# EAGLE schematic Main board (EAGLE 9.6.2)
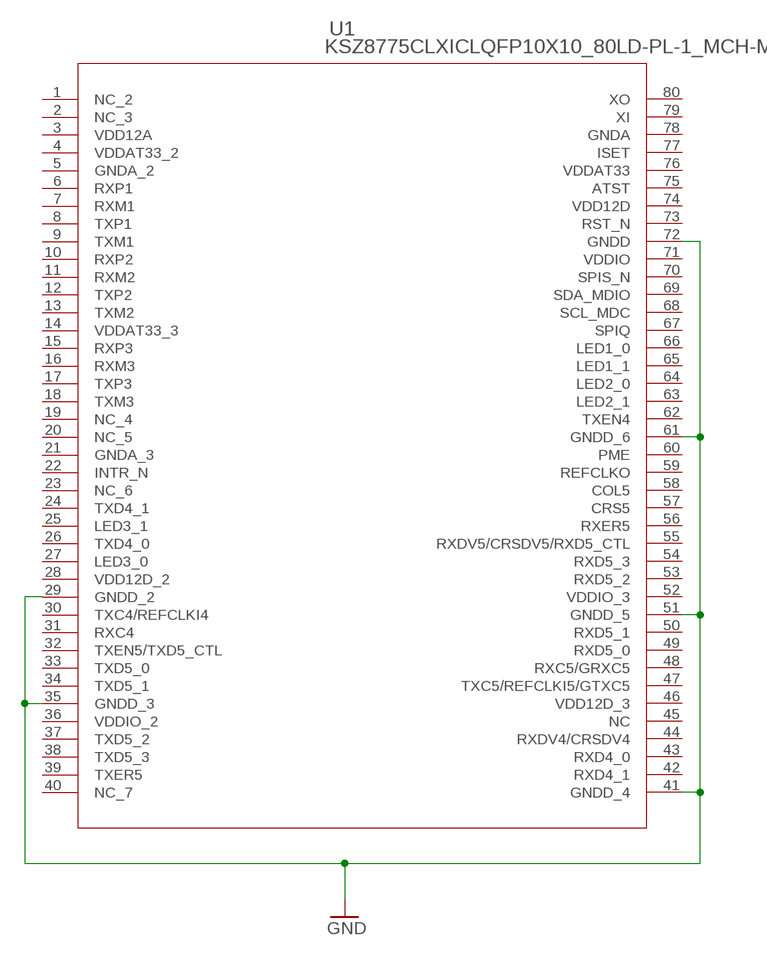
[diagram p0: schematic, sheet 1, part 1 of 2]
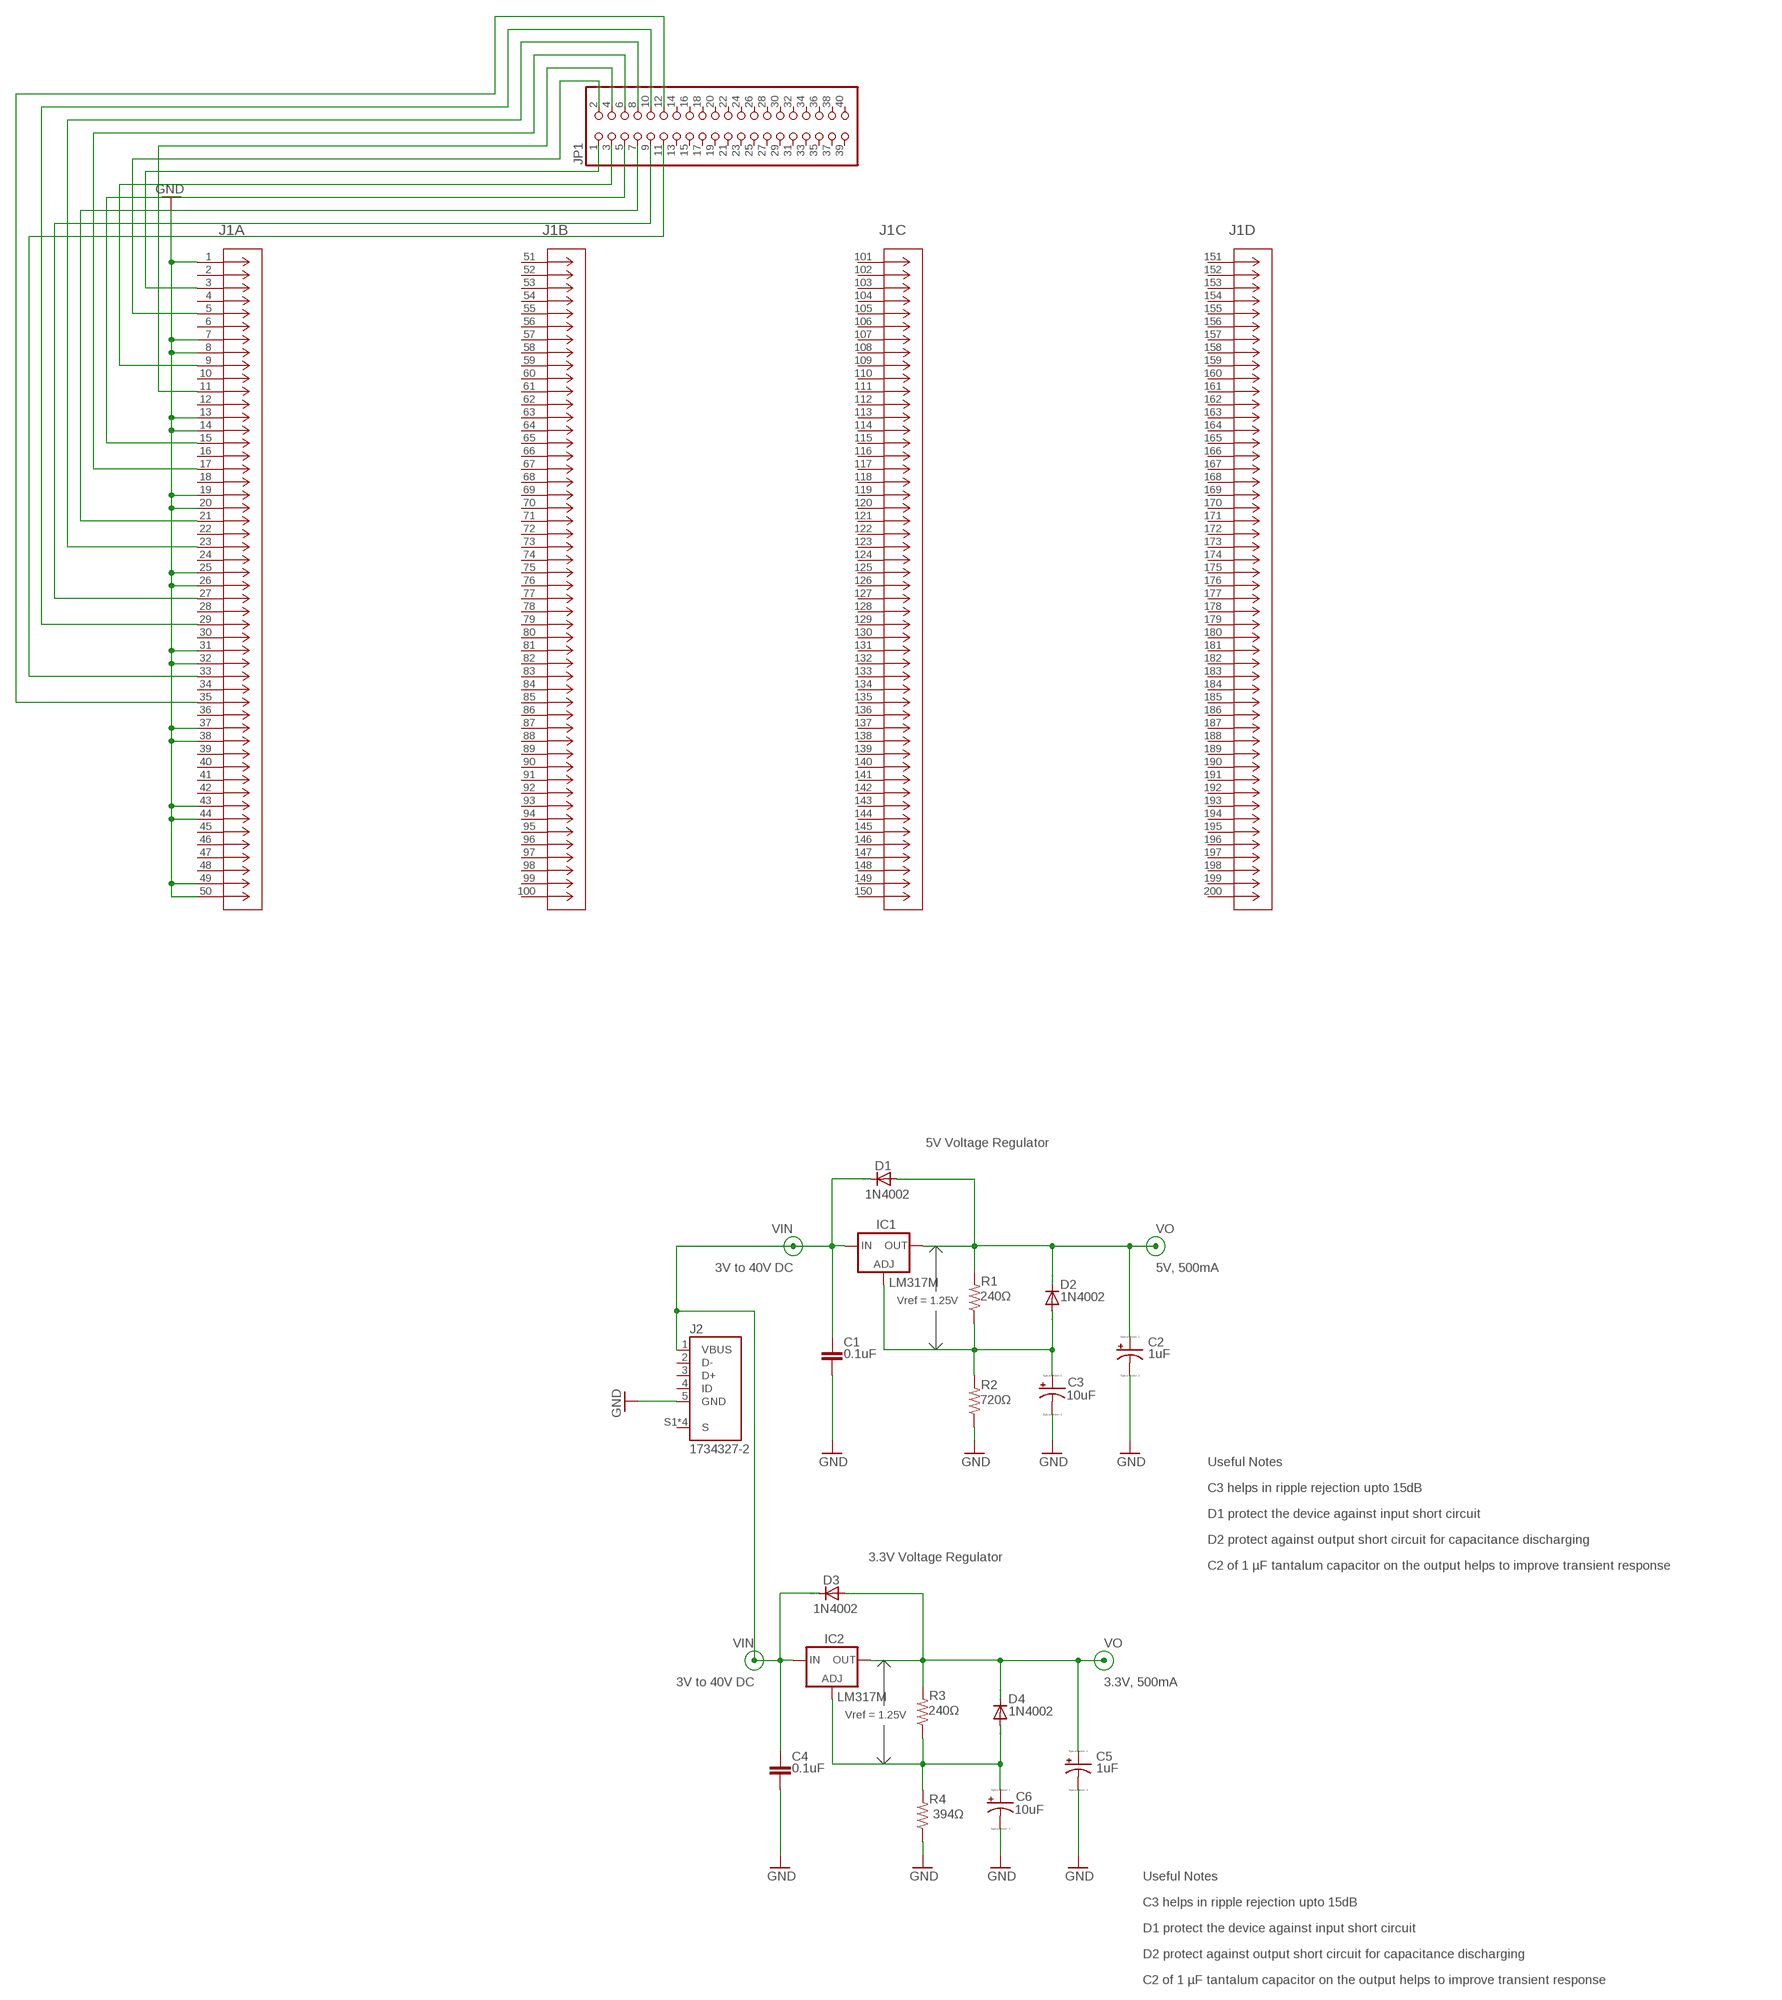
[diagram p1: schematic, sheet 1, part 2 of 2]

## Parts
C1  0.1uF  C-EU075-052X106  [C075-052X106]
C2  1uF  CPOL-US085CS-1AR  [085CS_1AR]
C3  10uF  CPOL-US085CS-1AR  [085CS_1AR]
C4  0.1uF  C-EU075-052X106  [C075-052X106]
C5  1uF  CPOL-US085CS-1AR  [085CS_1AR]
C6  10uF  CPOL-US085CS-1AR  [085CS_1AR]
D1  1N4002  1N4004  [DO41-10]
D2  1N4002  1N4004  [DO41-10]
D3  1N4002  1N4004  [DO41-10]
D4  1N4002  1N4004  [DO41-10]
IC1  LM317MBSTT3  [SOT223]
IC2  LM317MBSTT3  [SOT223]
J1  1473149-4  [CONN_1473149-4_TEC]
J2  1734327-2  [TE_1734327-2]
JP1  PINHD-2X20-BIG  [2X20-BIG]
R1  240Ω  R-US_M0805  [M0805]
R2  720Ω  R-US_M0805  [M0805]
R3  240Ω  R-US_M0805  [M0805]
R4  394Ω  R-US_M0805  [M0805]
U1  KSZ8775CLXICLQFP10X10_80LD-PL-1_MCH-M  [LQFP10X10_80LD-PL-1_MCH-M]

## Nets
GND: C1.2 C2.- C3.- C4.2 C5.- C6.- J1.1 J1.7 J1.8 J1.13 J1.14 J1.19 J1.20 J1.25 J1.26 J1.31 J1.32 J1.37 J1.38 J1.43 J1.44 J1.49 J1.50 J2.5(GND) R2.1 R4.1 U1.29(GNDD_2) U1.35(GNDD_3) U1.41(GNDD_4) U1.51(GNDD_5) U1.61(GNDD_6) U1.72(GNDD)
N$1: C3.+ D2.A IC1.1(ADJ) R1.1 R2.2
N$2: J1.3 JP1.1
N$3: C6.+ D4.A IC2.1(ADJ) R3.1 R4.2
N$4: J1.5 JP1.2
N$5: J1.9 JP1.3
N$6: J1.11 JP1.4
N$7: J1.15 JP1.5
N$8: J1.17 JP1.6
N$9: J1.21 JP1.7
N$10: J1.23 JP1.8
N$11: J1.27 JP1.9
N$12: J1.29 JP1.10
N$13: J1.33 JP1.11
N$14: J1.35 JP1.12
VIN: C1.1 C4.1 D1.C D3.C IC1.3(IN) IC2.3(IN) J2.1(VBUS)
VO: C2.+ C5.+ D1.A D2.C D3.A D4.C IC1.4(OUT) IC2.4(OUT) R1.2 R3.2
Unconnected: J1.2 J1.4 J1.6 J1.10 J1.12 J1.16 J1.18 J1.22 J1.24 J1.28 J1.30 J1.34 J1.36 J1.39 J1.40 J1.41 J1.42 J1.45 J1.46 J1.47 J1.48 J1.51 J1.52 J1.53 J1.54 J1.55 J1.56 J1.57 J1.58 J1.59 J1.60 J1.61 J1.62 J1.63 J1.64 J1.65 J1.66 J1.67 J1.68 J1.69 J1.70 J1.71 J1.72 J1.73 J1.74 J1.75 J1.76 J1.77 J1.78 J1.79 J1.80 J1.81 J1.82 J1.83 J1.84 J1.85 J1.86 J1.87 J1.88 J1.89 J1.90 J1.91 J1.92 J1.93 J1.94 J1.95 J1.96 J1.97 J1.98 J1.99 J1.100 J1.101 J1.102 J1.103 J1.104 J1.105 J1.106 J1.107 J1.108 J1.109 J1.110 J1.111 J1.112 J1.113 J1.114 J1.115 J1.116 J1.117 J1.118 J1.119 J1.120 J1.121 J1.122 J1.123 J1.124 J1.125 J1.126 J1.127 J1.128 J1.129 J1.130 J1.131 J1.132 J1.133 J1.134 J1.135 J1.136 J1.137 J1.138 J1.139 J1.140 J1.141 J1.142 J1.143 J1.144 J1.145 J1.146 J1.147 J1.148 J1.149 J1.150 J1.151 J1.152 J1.153 J1.154 J1.155 J1.156 J1.157 J1.158 J1.159 J1.160 J1.161 J1.162 J1.163 J1.164 J1.165 J1.166 J1.167 J1.168 J1.169 J1.170 J1.171 J1.172 J1.173 J1.174 J1.175 J1.176 J1.177 J1.178 J1.179 J1.180 J1.181 J1.182 J1.183 J1.184 J1.185 J1.186 J1.187 J1.188 J1.189 J1.190 J1.191 J1.192 J1.193 J1.194 J1.195 J1.196 J1.197 J1.198 J1.199 J1.200 J2.2(D-) J2.3(D+) J2.4(ID) JP1.13 JP1.14 JP1.15 JP1.16 JP1.17 JP1.18 JP1.19 JP1.20 JP1.21 JP1.22 JP1.23 JP1.24 JP1.25 JP1.26 JP1.27 JP1.28 JP1.29 JP1.30 JP1.31 JP1.32 JP1.33 JP1.34 JP1.35 JP1.36 JP1.37 JP1.38 JP1.39 JP1.40 U1.1(NC_2) U1.2(NC_3) U1.5(GNDA_2) U1.6(RXP1) U1.7(RXM1) U1.8(TXP1) U1.9(TXM1) U1.10(RXP2) U1.11(RXM2) U1.12(TXP2) U1.13(TXM2) U1.15(RXP3) U1.16(RXM3) U1.17(TXP3) U1.18(TXM3) U1.19(NC_4) U1.20(NC_5) U1.21(GNDA_3) U1.22(INTR_N) U1.23(NC_6) U1.24(TXD4_1) U1.25(LED3_1) U1.26(TXD4_0) U1.27(LED3_0) U1.30(TXC4/REFCLKI4) U1.31(RXC4) U1.32(TXEN5/TXD5_CTL) U1.33(TXD5_0) U1.34(TXD5_1) U1.37(TXD5_2) U1.38(TXD5_3) U1.39(TXER5) U1.40(NC_7) U1.42(RXD4_1) U1.43(RXD4_0) U1.44(RXDV4/CRSDV4) U1.45(NC) U1.47(TXC5/REFCLKI5/GTXC5) U1.48(RXC5/GRXC5) U1.49(RXD5_0) U1.50(RXD5_1) U1.53(RXD5_2) U1.54(RXD5_3) U1.55(RXDV5/CRSDV5/RXD5_CTL) U1.56(RXER5) U1.57(CRS5) U1.58(COL5) U1.59(REFCLKO) U1.60(PME) U1.62(TXEN4) U1.63(LED2_1) U1.64(LED2_0) U1.65(LED1_1) U1.66(LED1_0) U1.67(SPIQ) U1.68(SCL_MDC) U1.69(SDA_MDIO) U1.70(SPIS_N) U1.73(RST_N) U1.75(ATST) U1.77(ISET) U1.78(GNDA) U1.79(XI) U1.80(XO)

## Notes on the sheet
- 5V Voltage Regulator
- 3V to 40V DC | 5V, 500mA
- Vref = 1.25V
- Useful Notes
- C3 helps in ripple rejection upto 15dB
- D1 protect the device against input short circuit
- D2 protect against output short circuit for capacitance discharging
- 3.3V Voltage Regulator
- C2 of 1 µF tantalum capacitor on the output helps to improve transient response
- 3V to 40V DC | 3.3V, 500mA
- Vref = 1.25V
- Useful Notes
- C3 helps in ripple rejection upto 15dB
- D1 protect the device against input short circuit
- D2 protect against output short circuit for capacitance discharging
- C2 of 1 µF tantalum capacitor on the output helps to improve transient response

## Power pins joined to a net without a drawn wire
S: J2.S1(S) J2.S2(S) J2.S3(S) J2.S4(S)
VDD12A: U1.3(VDD12A)
VDD12D: U1.74(VDD12D)
VDD12D_2: U1.28(VDD12D_2)
VDD12D_3: U1.46(VDD12D_3)
VDDAT33: U1.76(VDDAT33)
VDDAT33_2: U1.4(VDDAT33_2)
VDDAT33_3: U1.14(VDDAT33_3)
VDDIO: U1.71(VDDIO)
VDDIO_2: U1.36(VDDIO_2)
VDDIO_3: U1.52(VDDIO_3)

## Library data of the parts
C1 C4 = rcl:C-EU: CAPACITOR, European symbol
C2 C3 C5 C6 = resistor:CPOL-US: POLARIZED CAPACITOR, American symbol
D1-D4 = diode:1N4004: DIODE general purpose rectifier, 1 A
IC1 IC2 = v-reg:LM317?*: 500 mA Adjustable Output Positive Voltage Regulator Source: http://www.onsemi.co.jp .. LM317M-D.PDF; PARTNUMBER: LM317M
J1 = ddr2 SODIMM:1473149-4; BUILT_BY: EMA_Cory; COPYRIGHT: Copyright (C) 2018 Accelerated Designs. All rights reserved; DATASHEET: https://www.te.com/commerce/DocumentDelivery/DDEController?Action=srchrtrv&DocNm=1473149&DocType=Customer+Drawing&DocLang=English; MANUFACTURER_PART_NUMBER: 1473149-4; SOURCELIBRARY: TE_Connectivity_2020-02-21; VENDOR: TE Connectivity
J2 = mini a usb:1734327-2: USB - mini A USB 2.0 Receptacle Connector 5 Position Surface Mount, Right Angle; COMMENT: 1734327-2; DESCRIPTION: Conn USB Type A RCP 5 POS 0.8mm Solder RA SMD 5 Terminal 1 Port T/R; DIGI-KEY_PART_NUMBER: A111051CT-ND; EU_ROHS_COMPLIANCE: Compliant; MF: TE Connectivity; MP: 1734327-2; PACKAGE: None; PURCHASE-URL: https://pricing.snapeda.com/search/part/1734327-2/?ref=eda
JP1 = adafruit:PINHD-2X20: PIN HEADER
R1-R4 = resistor:R-US_: RESISTOR, American symbol
U1 = library:KSZ8775CLXIC; BUILT_BY: EMA_Cory; COPYRIGHT: Copyright (C) 2018 Accelerated Designs. All rights reserved; DATASHEET: https://ww1.microchip.com/downloads/en/DeviceDoc/00002129C.pdf; MANUFACTURER_PART_NUMBER: KSZ8775CLXIC; SOURCELIBRARY: Add_to_database_2020-12-23; VENDOR: Microchip